# Altium project ThermalCamV1.PrjPcb
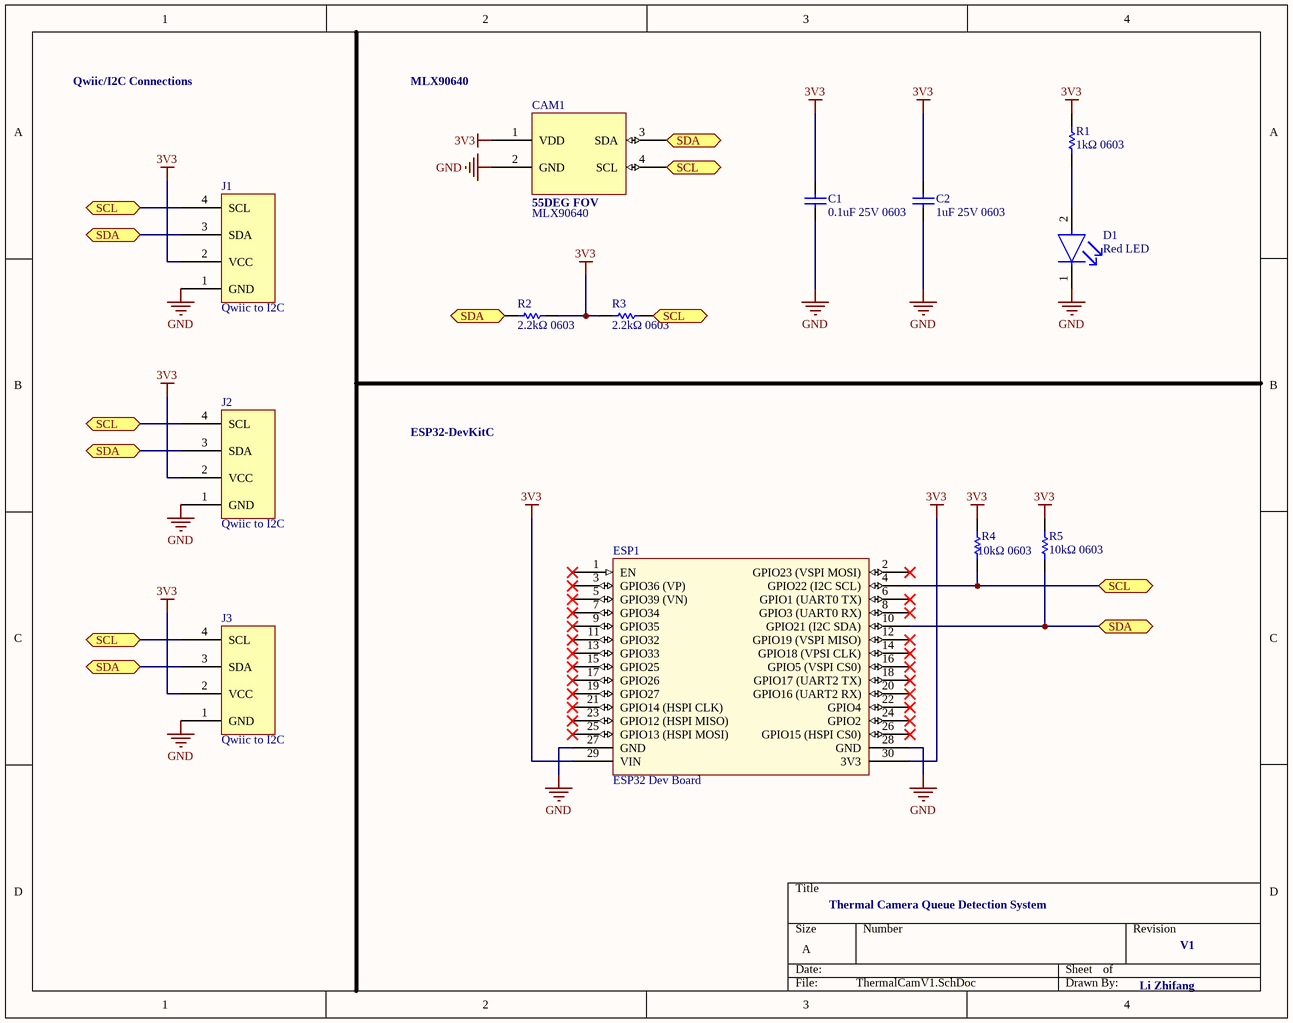
[diagram p0: ThermalCamV1.SchDoc]
1 sheet, 13 parts. Net scope: flat (ports and power ports of the same name join across sheets).

## Sheet ThermalCamV1.SchDoc
size A; SheetNumber: 1; SheetTotal: 1

### Parts
C1  0.1uF 25V 0603  [CAPC1608X87X35LL15T15]
C2  1uF 25V 0603  [CAPC1608X87X35LL15T15]
CAM1  MLX90640
D1  Red LED  [FP-HSMS-C170-MFG]
ESP1  ESP32 Dev Board
J1  Qwiic to I2C
J2  Qwiic to I2C
J3  Qwiic to I2C
R1  1kΩ 0603  [RESC1609X50X30NL8T20]
R2  2.2kΩ 0603  [RESC1609X50X30NL8T20]
R3  2.2kΩ 0603  [RESC1609X50X30NL8T20]
R4  10kΩ 0603  [RESC1609X50X30NL8T20]
R5  10kΩ 0603  [RESC1609X50X30NL8T20]

### Ports
SCL (bidir, see ThermalCamV1[1A], ThermalCamV1[1B], ThermalCamV1[1C], ThermalCamV1[3A], ThermalCamV1[3B]), SCL (bidir, see ThermalCamV1[1A], ThermalCamV1[1B], ThermalCamV1[1C], ThermalCamV1[3A], ThermalCamV1[4C]), SCL (bidir, see ThermalCamV1[1A], ThermalCamV1[1B], ThermalCamV1[1C], ThermalCamV1[3B], ThermalCamV1[4C]), SCL (bidir, see ThermalCamV1[1A], ThermalCamV1[1B], ThermalCamV1[3A], ThermalCamV1[3B], ThermalCamV1[4C]), SCL (bidir, see ThermalCamV1[1A], ThermalCamV1[1C], ThermalCamV1[3A], ThermalCamV1[3B], ThermalCamV1[4C]), SCL (bidir, see ThermalCamV1[1B], ThermalCamV1[1C], ThermalCamV1[3A], ThermalCamV1[3B], ThermalCamV1[4C]), SDA (bidir, see ThermalCamV1[1A], ThermalCamV1[1B], ThermalCamV1[1C], ThermalCamV1[2B], ThermalCamV1[3A]), SDA (bidir, see ThermalCamV1[1A], ThermalCamV1[1B], ThermalCamV1[1C], ThermalCamV1[2B], ThermalCamV1[4C]), SDA (bidir, see ThermalCamV1[1A], ThermalCamV1[1B], ThermalCamV1[1C], ThermalCamV1[3A], ThermalCamV1[4C]), SDA (bidir, see ThermalCamV1[1A], ThermalCamV1[1B], ThermalCamV1[2B], ThermalCamV1[3A], ThermalCamV1[4C]), SDA (bidir, see ThermalCamV1[1A], ThermalCamV1[1C], ThermalCamV1[2B], ThermalCamV1[3A], ThermalCamV1[4C]), SDA (bidir, see ThermalCamV1[1B], ThermalCamV1[1C], ThermalCamV1[2B], ThermalCamV1[3A], ThermalCamV1[4C])

### Nets
3V3: C1.2 C2.2 CAM1.1(VDD) ESP1.29(VIN) ESP1.30(3V3) J1.2(VCC) J2.2(VCC) J3.2(VCC) R1.1 R2.2 R3.1 R4.2 R5.2
GND: C1.1 C2.1 CAM1.2(GND) D1.1(C) ESP1.27(GND) ESP1.28(GND) J1.1(GND) J2.1(GND) J3.1(GND)
NetCAM1_3: CAM1.3(SDA) ESP1.10(GPIO21_(I2C_SDA)) J1.3(SDA) J2.3(SDA) J3.3(SDA) R2.1 R5.1 ; port SDA
NetCAM1_4: CAM1.4(SCL) ESP1.4(GPIO22_(I2C_SCL)) J1.4(SCL) J2.4(SCL) J3.4(SCL) R3.2 R4.1 ; port SCL
NetD1_2: D1.2(A) R1.2

Not connected (* = marked no-connect by the designer): ESP1 1(EN)* 2(GPIO23_(VSPI_MOSI))* 3(GPIO36_(VP))* 5(GPIO39_(VN))* 6(GPIO1_(UART0_TX))* 7(GPIO34)* 8(GPIO3_(UART0_RX))* 9(GPIO35)* 11(GPIO32)* 12(GPIO19_(VSPI_MISO))* 13(GPIO33)* 14(GPIO18_(VPSI_CLK))* 15(GPIO25)* 16(GPIO5_(VSPI_CS0))* 17(GPIO26)* 18(GPIO17_(UART2_TX))* 19(GPIO27)* 20(GPIO16_(UART2_RX))* 21(GPIO14_(HSPI_CLK))* 22(GPIO4)* 23(GPIO12_(HSPI_MISO))* 24(GPIO2)* 25(GPIO13_(HSPI_MOSI))* 26(GPIO15_(HSPI_CS0))*

### Notes on the sheet
- Qwiic/I2C Connections
- MLX90640
- ESP32-DevKitC
- Thermal Camera Queue Detection System
- Li Zhifang
- V1
- (in symbol MLX90640) 55DEG FOV

### Library data of the parts
C1 C2 = CMP-2006-03713-1: Part Number: C0603C105K3RACTU; Manufacturer: Kemet
D1 = CMP-18399-000018-1: LED RED DIFFUSED CHIP SMD; Forward Voltage: 2.1V; Shape: Rectangular; Wavelength: 626nm; Power Dissipation: 52mW; Reverse Voltage: 5V; Number of Elements: 1; Lens Color: White; Viewing Angle: 170°; Test Current: 20mA; Luminous Intensity: 10mcd; Number of Terminals: 2; Lead Free: Lead Free; Min Operating Temperature: -40°C; Package Quantity: 1; Depth: 1.25mm; Color: Red; Lens Style: Diffused; Mount: Surface Mount; Length: 2mm; Dominant Wavelength: 626nm; Packaging: Tape and Reel; Case Code (Metric): 2012; Max Operating Temperature: 85°C; Case Code (Imperial): 0805; Case/Package: 0805; Height: 0.8mm; Number of LEDs: 1; Illumination Color: Red; Width: 1.25mm; Radiation Hardening: No; Power Rating: 52mW; REACH SVHC: No SVHC; Number of Pins: 2; Lens Transparency: Diffused; Forward Current: 20mA
R1-R5 = CMP-2000-03816-5: Chip Resistor, 0 Ohm, Jumper, 100 mW, -55 to 155 degC, 0603 (1608 Metric), RoHS, Tape and Reel; Manufacturer: Vishay Semiconductor; Voltage Rating: 75 V; Package Quantity: 5000; DatasheetVersion: 06/2012; Min Operating Temperature: -55 degC; ComponentLink1URL: http://www.vishay.com/; Mounting Technology: Surface Mount; Height: 0.45 mm; ComponentLink1Description: Manufacturer URL; REACH SVHC: Unknown; PackageReference: 0603; Packaging: Tape and Reel; Max Operating Temperature: 155 degC; Mount: Surface Mount; ComponentLink2Description: Datasheet; PackageDescription: 2-Pin Surface Mount Device, Body 1.575 x 0.85 mm; Length: 1.55 mm; ComponentLink2URL: http://www.vishay.com/docs/20035/dcrcwe3.pdf; Pins: 2; RoHSCompliant: true